# Altium schematic sheet SHEET2.SCHDOC
size A3
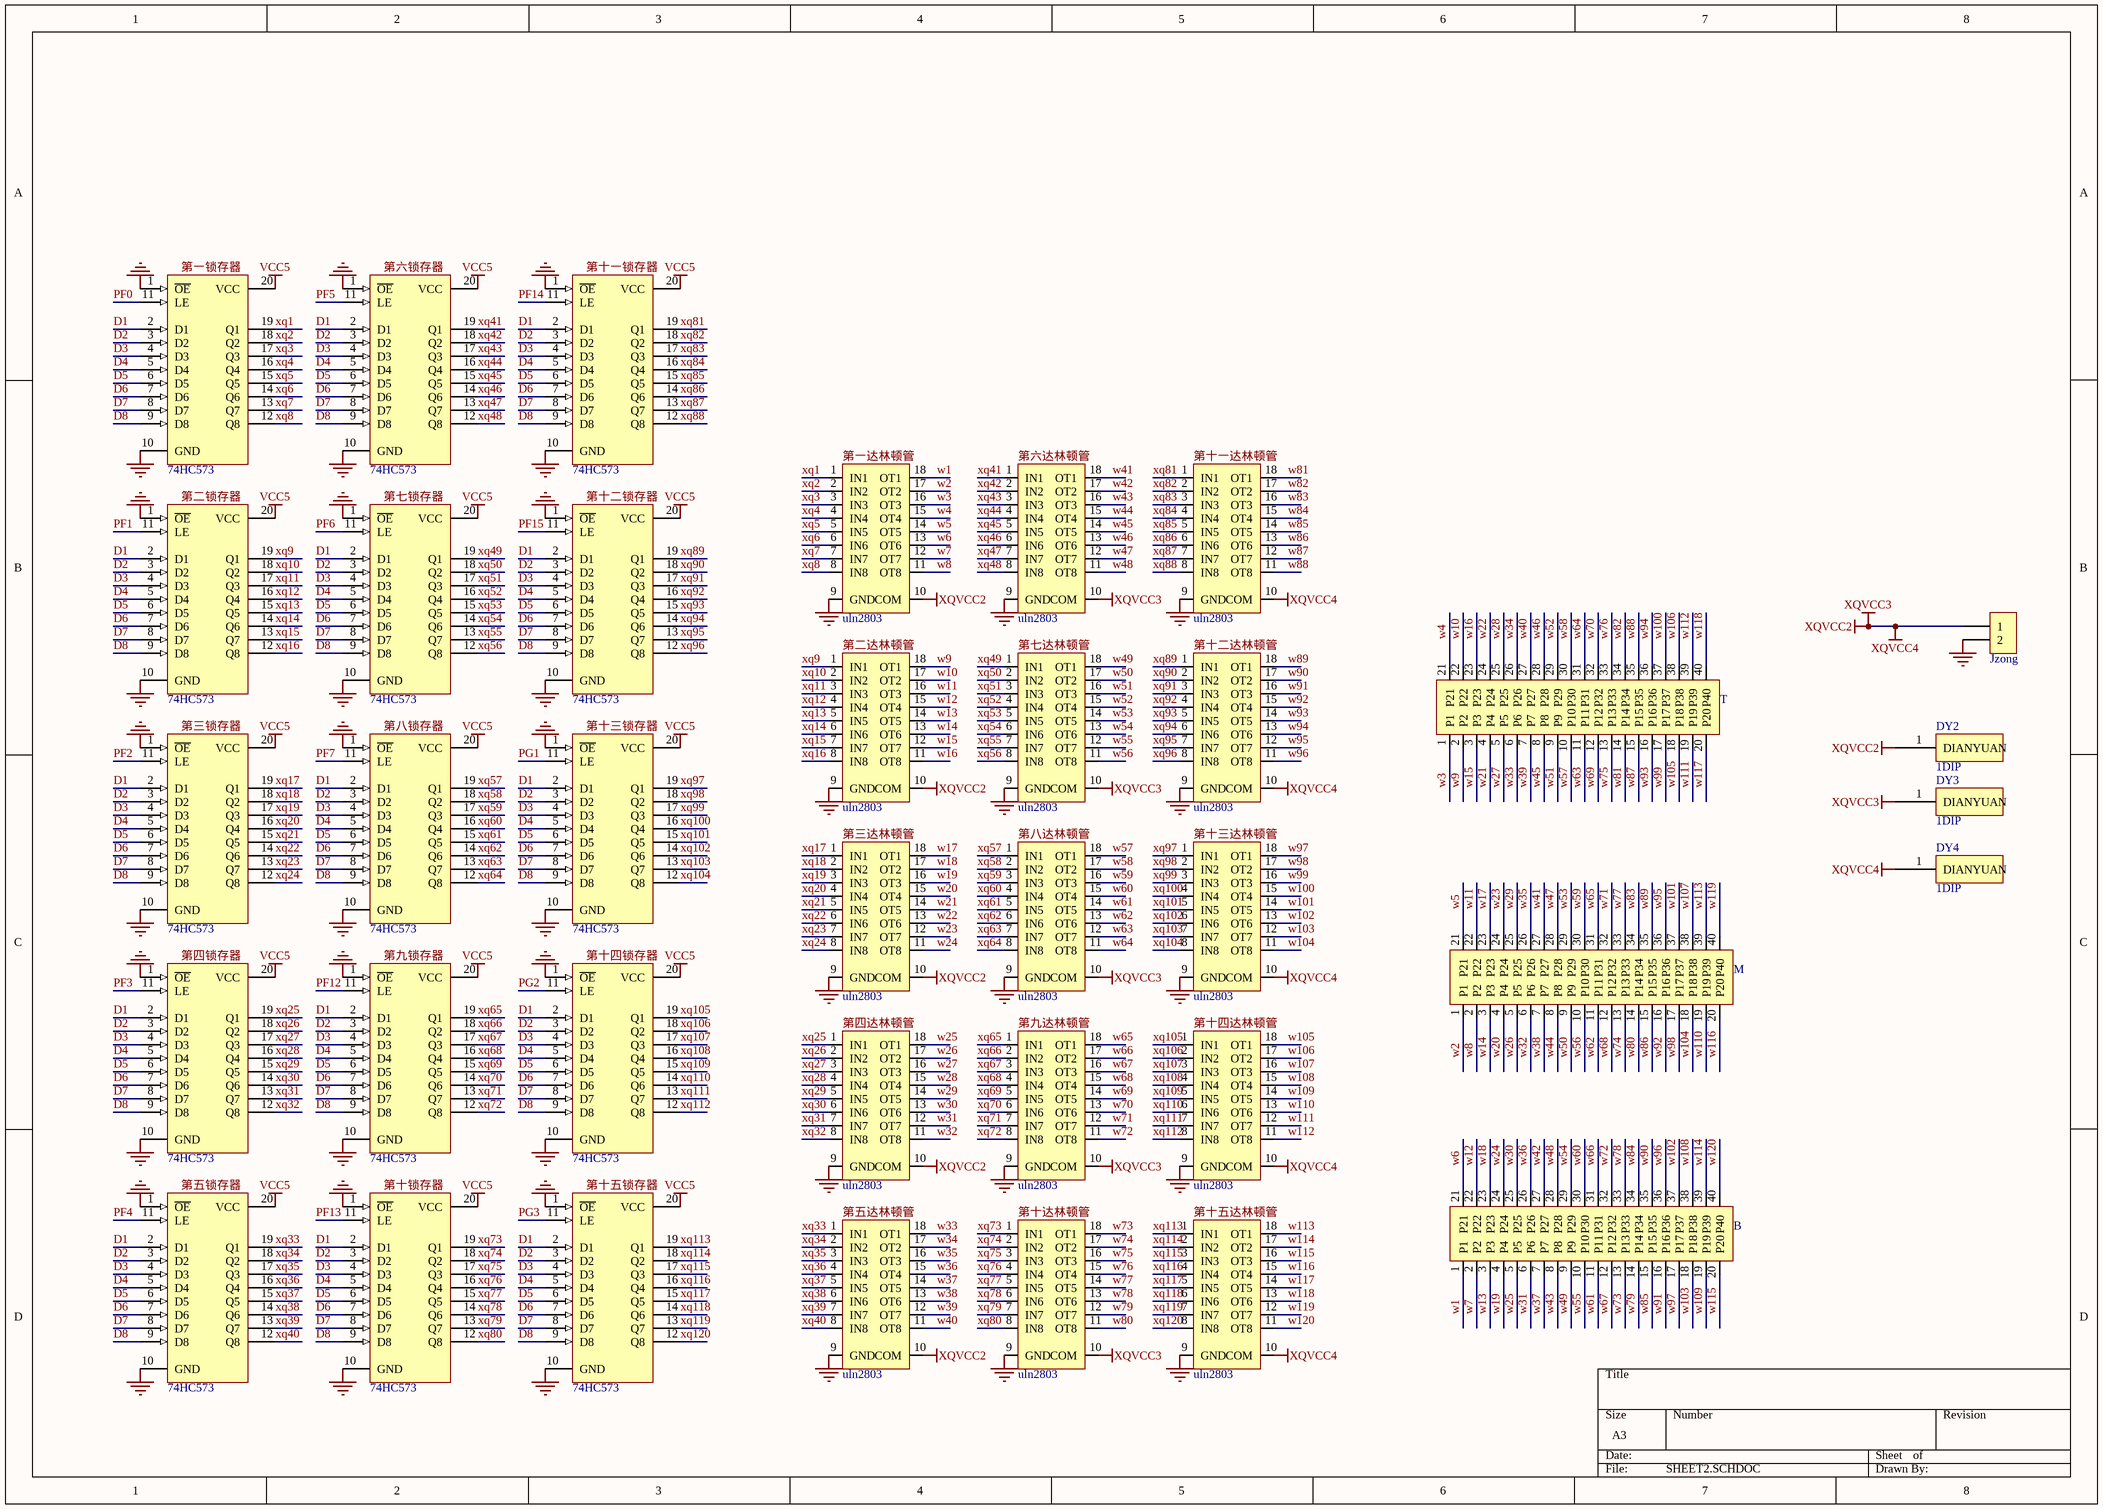
[diagram p0: SHEET2.SCHDOC]

## Parts
573_1  74HC573  [SOJ-20]
573_2  74HC573  [SOJ-20]
573_3  74HC573  [SOJ-20]
573_4  74HC573  [SOJ-20]
573_5  74HC573  [SOJ-20]
573_6  74HC573  [SOJ-20]
573_7  74HC573  [SOJ-20]
573_8  74HC573  [SOJ-20]
573_9  74HC573  [SOJ-20]
573_10  74HC573  [SOJ-20]
573_11  74HC573  [SOJ-20]
573_12  74HC573  [SOJ-20]
573_13  74HC573  [SOJ-20]
573_14  74HC573  [SOJ-20]
573_15  74HC573  [SOJ-20]
B  dubangxian  [杜邦线插脚]  (value not drawn)
DY2  1DIP  [1DIP]
DY3  1DIP  [1DIP]
DY4  1DIP  [1DIP]
FD1  uln2803  [dip-18]
FD2  uln2803  [dip-18]
FD3  uln2803  [dip-18]
FD4  uln2803  [dip-18]
FD5  uln2803  [dip-18]
FD6  uln2803  [dip-18]
FD7  uln2803  [dip-18]
FD8  uln2803  [dip-18]
FD9  uln2803  [dip-18]
FD10  uln2803  [dip-18]
FD11  uln2803  [dip-18]
FD12  uln2803  [dip-18]
FD13  uln2803  [dip-18]
FD14  uln2803  [dip-18]
FD15  uln2803  [dip-18]
Jzong  CON2  [dc005]  (value not drawn)
M  dubangxian  [杜邦线插脚]  (value not drawn)
T  dubangxian  [杜邦线插脚]  (value not drawn)

## Nets
GND: 573_1.1(~{OE}) 573_1.10(GND) 573_2.1(~{OE}) 573_2.10(GND) 573_3.1(~{OE}) 573_3.10(GND) 573_4.1(~{OE}) 573_4.10(GND) 573_5.1(~{OE}) 573_5.10(GND) 573_6.1(~{OE}) 573_6.10(GND) 573_7.1(~{OE}) 573_7.10(GND) 573_8.1(~{OE}) 573_8.10(GND) 573_9.1(~{OE}) 573_9.10(GND) 573_10.1(~{OE}) 573_10.10(GND) 573_11.1(~{OE}) 573_11.10(GND) 573_12.1(~{OE}) 573_12.10(GND) 573_13.1(~{OE}) 573_13.10(GND) 573_14.1(~{OE}) 573_14.10(GND) 573_15.1(~{OE}) 573_15.10(GND) FD1.9(GND) FD2.9(GND) FD3.9(GND) FD4.9(GND) FD5.9(GND) FD6.9(GND) FD7.9(GND) FD8.9(GND) FD9.9(GND) FD10.9(GND) FD11.9(GND) FD12.9(GND) FD13.9(GND) FD14.9(GND) FD15.9(GND) Jzong.2
VCC5: 573_1.20(VCC) 573_2.20(VCC) 573_3.20(VCC) 573_4.20(VCC) 573_5.20(VCC) 573_6.20(VCC) 573_7.20(VCC) 573_8.20(VCC) 573_9.20(VCC) 573_10.20(VCC) 573_11.20(VCC) 573_12.20(VCC) 573_13.20(VCC) 573_14.20(VCC) 573_15.20(VCC)
XQVCC2: DY2.1(DIANYUAN) DY3.1(DIANYUAN) DY4.1(DIANYUAN) FD1.10(COM) FD2.10(COM) FD3.10(COM) FD4.10(COM) FD5.10(COM) FD6.10(COM) FD7.10(COM) FD8.10(COM) FD9.10(COM) FD10.10(COM) FD11.10(COM) FD12.10(COM) FD13.10(COM) FD14.10(COM) FD15.10(COM) Jzong.1  [also labelled XQVCC3, XQVCC4]
D1: 573_1.2(D1) 573_2.2(D1) 573_3.2(D1) 573_4.2(D1) 573_5.2(D1) 573_6.2(D1) 573_7.2(D1) 573_8.2(D1) 573_9.2(D1) 573_10.2(D1) 573_11.2(D1) 573_12.2(D1) 573_13.2(D1) 573_14.2(D1) 573_15.2(D1)
D2: 573_1.3(D2) 573_2.3(D2) 573_3.3(D2) 573_4.3(D2) 573_5.3(D2) 573_6.3(D2) 573_7.3(D2) 573_8.3(D2) 573_9.3(D2) 573_10.3(D2) 573_11.3(D2) 573_12.3(D2) 573_13.3(D2) 573_14.3(D2) 573_15.3(D2)
D3: 573_1.4(D3) 573_2.4(D3) 573_3.4(D3) 573_4.4(D3) 573_5.4(D3) 573_6.4(D3) 573_7.4(D3) 573_8.4(D3) 573_9.4(D3) 573_10.4(D3) 573_11.4(D3) 573_12.4(D3) 573_13.4(D3) 573_14.4(D3) 573_15.4(D3)
D4: 573_1.5(D4) 573_2.5(D4) 573_3.5(D4) 573_4.5(D4) 573_5.5(D4) 573_6.5(D4) 573_7.5(D4) 573_8.5(D4) 573_9.5(D4) 573_10.5(D4) 573_11.5(D4) 573_12.5(D4) 573_13.5(D4) 573_14.5(D4) 573_15.5(D4)
D5: 573_1.6(D5) 573_2.6(D5) 573_3.6(D5) 573_4.6(D5) 573_5.6(D5) 573_6.6(D5) 573_7.6(D5) 573_8.6(D5) 573_9.6(D5) 573_10.6(D5) 573_11.6(D5) 573_12.6(D5) 573_13.6(D5) 573_14.6(D5) 573_15.6(D5)
D6: 573_1.7(D6) 573_2.7(D6) 573_3.7(D6) 573_4.7(D6) 573_5.7(D6) 573_6.7(D6) 573_7.7(D6) 573_8.7(D6) 573_9.7(D6) 573_10.7(D6) 573_11.7(D6) 573_12.7(D6) 573_13.7(D6) 573_14.7(D6) 573_15.7(D6)
D7: 573_1.8(D7) 573_2.8(D7) 573_3.8(D7) 573_4.8(D7) 573_5.8(D7) 573_6.8(D7) 573_7.8(D7) 573_8.8(D7) 573_9.8(D7) 573_10.8(D7) 573_11.8(D7) 573_12.8(D7) 573_13.8(D7) 573_14.8(D7) 573_15.8(D7)
D8: 573_1.9(D8) 573_2.9(D8) 573_3.9(D8) 573_4.9(D8) 573_5.9(D8) 573_6.9(D8) 573_7.9(D8) 573_8.9(D8) 573_9.9(D8) 573_10.9(D8) 573_11.9(D8) 573_12.9(D8) 573_13.9(D8) 573_14.9(D8) 573_15.9(D8)
PF0: 573_1.11(LE)
PF1: 573_2.11(LE)
PF2: 573_3.11(LE)
PF3: 573_4.11(LE)
PF4: 573_5.11(LE)
PF5: 573_7.11(LE)
PF6: 573_8.11(LE)
PF7: 573_9.11(LE)
PF12: 573_10.11(LE)
PF13: 573_11.11(LE)
PF14: 573_12.11(LE)
PF15: 573_13.11(LE)
PG1: 573_14.11(LE)
PG2: 573_15.11(LE)
PG3: 573_6.11(LE)
w1: B.1(P1) FD1.18(OT1)
w2: FD1.17(OT2) M.1(P1)
w3: FD1.16(OT3) T.1(P1)
w4: FD1.15(OT4) T.21(P21)
w5: FD1.14(OT5) M.21(P21)
w6: B.21(P21) FD1.13(OT6)
w7: B.2(P2) FD1.12(OT7)
w8: FD1.11(OT8) M.2(P2)
w9: FD2.18(OT1) T.2(P2)
w10: FD2.17(OT2) T.22(P22)
w11: FD2.16(OT3) M.22(P22)
w12: B.22(P22) FD2.15(OT4)
w13: B.3(P3) FD2.14(OT5)
w14: FD2.13(OT6) M.3(P3)
w15: FD2.12(OT7) T.3(P3)
w16: FD2.11(OT8) T.23(P23)
w17: FD3.18(OT1) M.23(P23)
w18: B.23(P23) FD3.17(OT2)
w19: B.4(P4) FD3.16(OT3)
w20: FD3.15(OT4) M.4(P4)
w21: FD3.14(OT5) T.4(P4)
w22: FD3.13(OT6) T.24(P24)
w23: FD3.12(OT7) M.24(P24)
w24: B.24(P24) FD3.11(OT8)
w25: B.5(P5) FD4.18(OT1)
w26: FD4.17(OT2) M.5(P5)
w27: FD4.16(OT3) T.5(P5)
w28: FD4.15(OT4) T.25(P25)
w29: FD4.14(OT5) M.25(P25)
w30: B.25(P25) FD4.13(OT6)
w31: B.6(P6) FD4.12(OT7)
w32: FD4.11(OT8) M.6(P6)
w33: FD5.18(OT1) T.6(P6)
w34: FD5.17(OT2) T.26(P26)
w35: FD5.16(OT3) M.26(P26)
w36: B.26(P26) FD5.15(OT4)
w37: B.7(P7) FD5.14(OT5)
w38: FD5.13(OT6) M.7(P7)
w39: FD5.12(OT7) T.7(P7)
w40: FD5.11(OT8) T.27(P27)
w41: FD6.18(OT1) M.27(P27)
w42: B.27(P27) FD6.17(OT2)
w43: B.8(P8) FD6.16(OT3)
w44: FD6.15(OT4) M.8(P8)
w45: FD6.14(OT5) T.8(P8)
w46: FD6.13(OT6) T.28(P28)
w47: FD6.12(OT7) M.28(P28)
w48: B.28(P28) FD6.11(OT8)
w49: B.9(P9) FD7.18(OT1)
w50: FD7.17(OT2) M.9(P9)
w51: FD7.16(OT3) T.9(P9)
w52: FD7.15(OT4) T.29(P29)
w53: FD7.14(OT5) M.29(P29)
w54: B.29(P29) FD7.13(OT6)
w55: B.10(P10) FD7.12(OT7)
w56: FD7.11(OT8) M.10(P10)
w57: FD8.18(OT1) T.10(P10)
w58: FD8.17(OT2) T.30(P30)
w59: FD8.16(OT3) M.30(P30)
w60: B.30(P30) FD8.15(OT4)
w61: B.11(P11) FD8.14(OT5)
w62: FD8.13(OT6) M.11(P11)
w63: FD8.12(OT7) T.11(P11)
w64: FD8.11(OT8) T.31(P31)
w65: FD9.18(OT1) M.31(P31)
w66: B.31(P31) FD9.17(OT2)
w67: B.12(P12) FD9.16(OT3)
w68: FD9.15(OT4) M.12(P12)
w69: FD9.14(OT5) T.12(P12)
w70: FD9.13(OT6) T.32(P32)
w71: FD9.12(OT7) M.32(P32)
w72: B.32(P32) FD9.11(OT8)
w73: B.13(P13) FD10.18(OT1)
w74: FD10.17(OT2) M.13(P13)
w75: FD10.16(OT3) T.13(P13)
w76: FD10.15(OT4) T.33(P33)
w77: FD10.14(OT5) M.33(P33)
w78: B.33(P33) FD10.13(OT6)
w79: B.14(P14) FD10.12(OT7)
w80: FD10.11(OT8) M.14(P14)
w81: FD11.18(OT1) T.14(P14)
w82: FD11.17(OT2) T.34(P34)
w83: FD11.16(OT3) M.34(P34)
w84: B.34(P34) FD11.15(OT4)
w85: B.15(P15) FD11.14(OT5)
w86: FD11.13(OT6) M.15(P15)
w87: FD11.12(OT7) T.15(P15)
w88: FD11.11(OT8) T.35(P35)
w89: FD12.18(OT1) M.35(P35)
w90: B.35(P35) FD12.17(OT2)
w91: B.16(P16) FD12.16(OT3)
w92: FD12.15(OT4) M.16(P16)
w93: FD12.14(OT5) T.16(P16)
w94: FD12.13(OT6) T.36(P36)
w95: FD12.12(OT7) M.36(P36)
w96: B.36(P36) FD12.11(OT8)
w97: B.17(P17) FD13.18(OT1)
w98: FD13.17(OT2) M.17(P17)
w99: FD13.16(OT3) T.17(P17)
w100: FD13.15(OT4) T.37(P37)
w101: FD13.14(OT5) M.37(P37)
w102: B.37(P37) FD13.13(OT6)
w103: B.18(P18) FD13.12(OT7)
w104: FD13.11(OT8) M.18(P18)
w105: FD14.18(OT1) T.18(P18)
w106: FD14.17(OT2) T.38(P38)
w107: FD14.16(OT3) M.38(P38)
w108: B.38(P38) FD14.15(OT4)
w109: B.19(P19) FD14.14(OT5)
w110: FD14.13(OT6) M.19(P19)
w111: FD14.12(OT7) T.19(P19)
w112: FD14.11(OT8) T.39(P39)
w113: FD15.18(OT1) M.39(P39)
w114: B.39(P39) FD15.17(OT2)
w115: B.20(P20) FD15.16(OT3)
w116: FD15.15(OT4) M.20(P20)
w117: FD15.14(OT5) T.20(P20)
w118: FD15.13(OT6) T.40(P40)
w119: FD15.12(OT7) M.40(P40)
w120: B.40(P40) FD15.11(OT8)
xq1: 573_1.19(Q1) FD1.1(IN1)
xq2: 573_1.18(Q2) FD1.2(IN2)
xq3: 573_1.17(Q3) FD1.3(IN3)
xq4: 573_1.16(Q4) FD1.4(IN4)
xq5: 573_1.15(Q5) FD1.5(IN5)
xq6: 573_1.14(Q6) FD1.6(IN6)
xq7: 573_1.13(Q7) FD1.7(IN7)
xq8: 573_1.12(Q8) FD1.8(IN8)
xq9: 573_2.19(Q1) FD2.1(IN1)
xq10: 573_2.18(Q2) FD2.2(IN2)
xq11: 573_2.17(Q3) FD2.3(IN3)
xq12: 573_2.16(Q4) FD2.4(IN4)
xq13: 573_2.15(Q5) FD2.5(IN5)
xq14: 573_2.14(Q6) FD2.6(IN6)
xq15: 573_2.13(Q7) FD2.7(IN7)
xq16: 573_2.12(Q8) FD2.8(IN8)
xq17: 573_3.19(Q1) FD3.1(IN1)
xq18: 573_3.18(Q2) FD3.2(IN2)
xq19: 573_3.17(Q3) FD3.3(IN3)
xq20: 573_3.16(Q4) FD3.4(IN4)
xq21: 573_3.15(Q5) FD3.5(IN5)
xq22: 573_3.14(Q6) FD3.6(IN6)
xq23: 573_3.13(Q7) FD3.7(IN7)
xq24: 573_3.12(Q8) FD3.8(IN8)
xq25: 573_4.19(Q1) FD4.1(IN1)
xq26: 573_4.18(Q2) FD4.2(IN2)
xq27: 573_4.17(Q3) FD4.3(IN3)
xq28: 573_4.16(Q4) FD4.4(IN4)
xq29: 573_4.15(Q5) FD4.5(IN5)
xq30: 573_4.14(Q6) FD4.6(IN6)
xq31: 573_4.13(Q7) FD4.7(IN7)
xq32: 573_4.12(Q8) FD4.8(IN8)
xq33: 573_5.19(Q1) FD5.1(IN1)
xq34: 573_5.18(Q2) FD5.2(IN2)
xq35: 573_5.17(Q3) FD5.3(IN3)
xq36: 573_5.16(Q4) FD5.4(IN4)
xq37: 573_5.15(Q5) FD5.5(IN5)
xq38: 573_5.14(Q6) FD5.6(IN6)
xq39: 573_5.13(Q7) FD5.7(IN7)
xq40: 573_5.12(Q8) FD5.8(IN8)
xq41: 573_7.19(Q1) FD6.1(IN1)
xq42: 573_7.18(Q2) FD6.2(IN2)
xq43: 573_7.17(Q3) FD6.3(IN3)
xq44: 573_7.16(Q4) FD6.4(IN4)
xq45: 573_7.15(Q5) FD6.5(IN5)
xq46: 573_7.14(Q6) FD6.6(IN6)
xq47: 573_7.13(Q7) FD6.7(IN7)
xq48: 573_7.12(Q8) FD6.8(IN8)
xq49: 573_8.19(Q1) FD7.1(IN1)
xq50: 573_8.18(Q2) FD7.2(IN2)
xq51: 573_8.17(Q3) FD7.3(IN3)
xq52: 573_8.16(Q4) FD7.4(IN4)
xq53: 573_8.15(Q5) FD7.5(IN5)
xq54: 573_8.14(Q6) FD7.6(IN6)
xq55: 573_8.13(Q7) FD7.7(IN7)
xq56: 573_8.12(Q8) FD7.8(IN8)
xq57: 573_9.19(Q1) FD8.1(IN1)
xq58: 573_9.18(Q2) FD8.2(IN2)
xq59: 573_9.17(Q3) FD8.3(IN3)
xq60: 573_9.16(Q4) FD8.4(IN4)
xq61: 573_9.15(Q5) FD8.5(IN5)
xq62: 573_9.14(Q6) FD8.6(IN6)
xq63: 573_9.13(Q7) FD8.7(IN7)
xq64: 573_9.12(Q8) FD8.8(IN8)
xq65: 573_10.19(Q1) FD9.1(IN1)
xq66: 573_10.18(Q2) FD9.2(IN2)
xq67: 573_10.17(Q3) FD9.3(IN3)
xq68: 573_10.16(Q4) FD9.4(IN4)
xq69: 573_10.15(Q5) FD9.5(IN5)
xq70: 573_10.14(Q6) FD9.6(IN6)
xq71: 573_10.13(Q7) FD9.7(IN7)
xq72: 573_10.12(Q8) FD9.8(IN8)
xq73: 573_11.19(Q1) FD10.1(IN1)
xq74: 573_11.18(Q2) FD10.2(IN2)
xq75: 573_11.17(Q3) FD10.3(IN3)
xq76: 573_11.16(Q4) FD10.4(IN4)
xq77: 573_11.15(Q5) FD10.5(IN5)
xq78: 573_11.14(Q6) FD10.6(IN6)
xq79: 573_11.13(Q7) FD10.7(IN7)
xq80: 573_11.12(Q8) FD10.8(IN8)
xq81: 573_12.19(Q1) FD11.1(IN1)
xq82: 573_12.18(Q2) FD11.2(IN2)
xq83: 573_12.17(Q3) FD11.3(IN3)
xq84: 573_12.16(Q4) FD11.4(IN4)
xq85: 573_12.15(Q5) FD11.5(IN5)
xq86: 573_12.14(Q6) FD11.6(IN6)
xq87: 573_12.13(Q7) FD11.7(IN7)
xq88: 573_12.12(Q8) FD11.8(IN8)
xq89: 573_13.19(Q1) FD12.1(IN1)
xq90: 573_13.18(Q2) FD12.2(IN2)
xq91: 573_13.17(Q3) FD12.3(IN3)
xq92: 573_13.16(Q4) FD12.4(IN4)
xq93: 573_13.15(Q5) FD12.5(IN5)
xq94: 573_13.14(Q6) FD12.6(IN6)
xq95: 573_13.13(Q7) FD12.7(IN7)
xq96: 573_13.12(Q8) FD12.8(IN8)
xq97: 573_14.19(Q1) FD13.1(IN1)
xq98: 573_14.18(Q2) FD13.2(IN2)
xq99: 573_14.17(Q3) FD13.3(IN3)
xq100: 573_14.16(Q4) FD13.4(IN4)
xq101: 573_14.15(Q5) FD13.5(IN5)
xq102: 573_14.14(Q6) FD13.6(IN6)
xq103: 573_14.13(Q7) FD13.7(IN7)
xq104: 573_14.12(Q8) FD13.8(IN8)
xq105: 573_15.19(Q1) FD14.1(IN1)
xq106: 573_15.18(Q2) FD14.2(IN2)
xq107: 573_15.17(Q3) FD14.3(IN3)
xq108: 573_15.16(Q4) FD14.4(IN4)
xq109: 573_15.15(Q5) FD14.5(IN5)
xq110: 573_15.14(Q6) FD14.6(IN6)
xq111: 573_15.13(Q7) FD14.7(IN7)
xq112: 573_15.12(Q8) FD14.8(IN8)
xq113: 573_6.19(Q1) FD15.1(IN1)
xq114: 573_6.18(Q2) FD15.2(IN2)
xq115: 573_6.17(Q3) FD15.3(IN3)
xq116: 573_6.16(Q4) FD15.4(IN4)
xq117: 573_6.15(Q5) FD15.5(IN5)
xq118: 573_6.14(Q6) FD15.6(IN6)
xq119: 573_6.13(Q7) FD15.7(IN7)
xq120: 573_6.12(Q8) FD15.8(IN8)

## Notes on the sheet
- Labels drawn without touching a wire or pin: 第一达林顿管, 第一锁存器, 第七达林顿管, 第七锁存器, 第三达林顿管, 第三锁存器, 第九达林顿管, 第九锁存器, 第二达林顿管, 第二锁存器, 第五达林顿管, 第五锁存器, 第八达林顿管, 第八锁存器, 第六达林顿管, 第六锁存器, 第十一达林顿管, 第十一锁存器, 第十三达林顿管, 第十三锁存器, 第十二达林顿管, 第十二锁存器, 第十五达林顿管, 第十五锁存器, 第十四达林顿管, 第十四锁存器, 第十达林顿管, 第十锁存器, 第四达林顿管, 第四锁存器

## Library data of the parts
573_1-573_15 = SN74HC573DW: Octal D-Type Transparent Latch with 3-State Outputs; Published: 8-Jun-2000; LatestRevisionDate: 13-Apr-2006; LatestRevisionNote: IPC-7351 Footprint Added.; DatasheetVersion: Jun-1989; PackageVersion: Mar-2000; PackageReference: DW020; Publisher: Altium Limited; PackageDescription: 20-Pin Plastic Small Outline Integrated Circuit 1.27 mm Pitch; Code_JEDEC: MS-013; Code_IPC: SOIC127P1030-20; ComponentLink1Description: Manufacturer Link; ComponentLink1URL: http://www.ti.com/
Jzong = CON2: Connector